# Altium project VLC_RX.PrjPcb
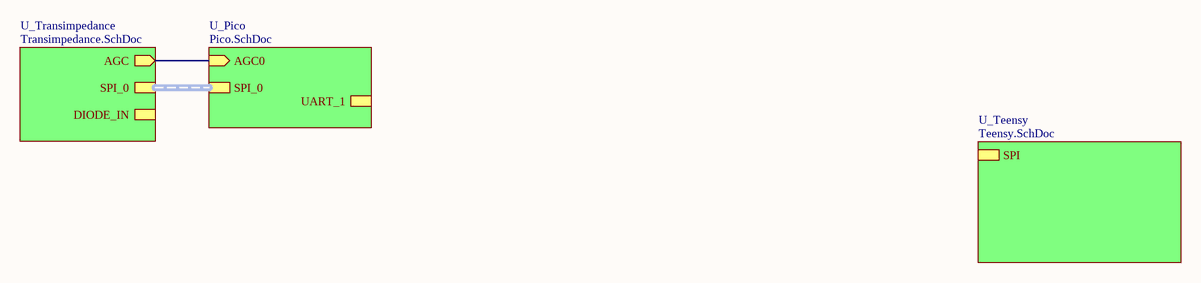
[diagram p0: VLC_RX.SchDoc]
4 sheets, 29 parts. Net scope: hierarchical (ports join the sheet entries above them; power ports are global).
Sheets:
  VLC_RX.SchDoc
    U_Pico = Pico.SchDoc
    U_Teensy = Teensy.SchDoc
    U_Transimpedance = Transimpedance.SchDoc

## Sheet VLC_RX.SchDoc
size A4; SheetNumber: 1; SheetTotal: 4

### Sub-sheets
U_Pico = Pico.SchDoc: SPI_0 (harness SPI_0), AGC0 (in), UART_1 (harness UART_1)
U_Teensy = Teensy.SchDoc: SPI (harness SPI)
U_Transimpedance = Transimpedance.SchDoc: DIODE_IN, SPI_0 (harness SPI_0), AGC (out)

### Nets
GPIO26: sheet U_Pico/AGC0, sheet U_Transimpedance/AGC

### Buses and harness runs
harness sheet U_Pico/SPI_0 = sheet U_Transimpedance/SPI_0

## Sheet Pico.SchDoc
size A4; SheetNumber: 3; SheetTotal: 4
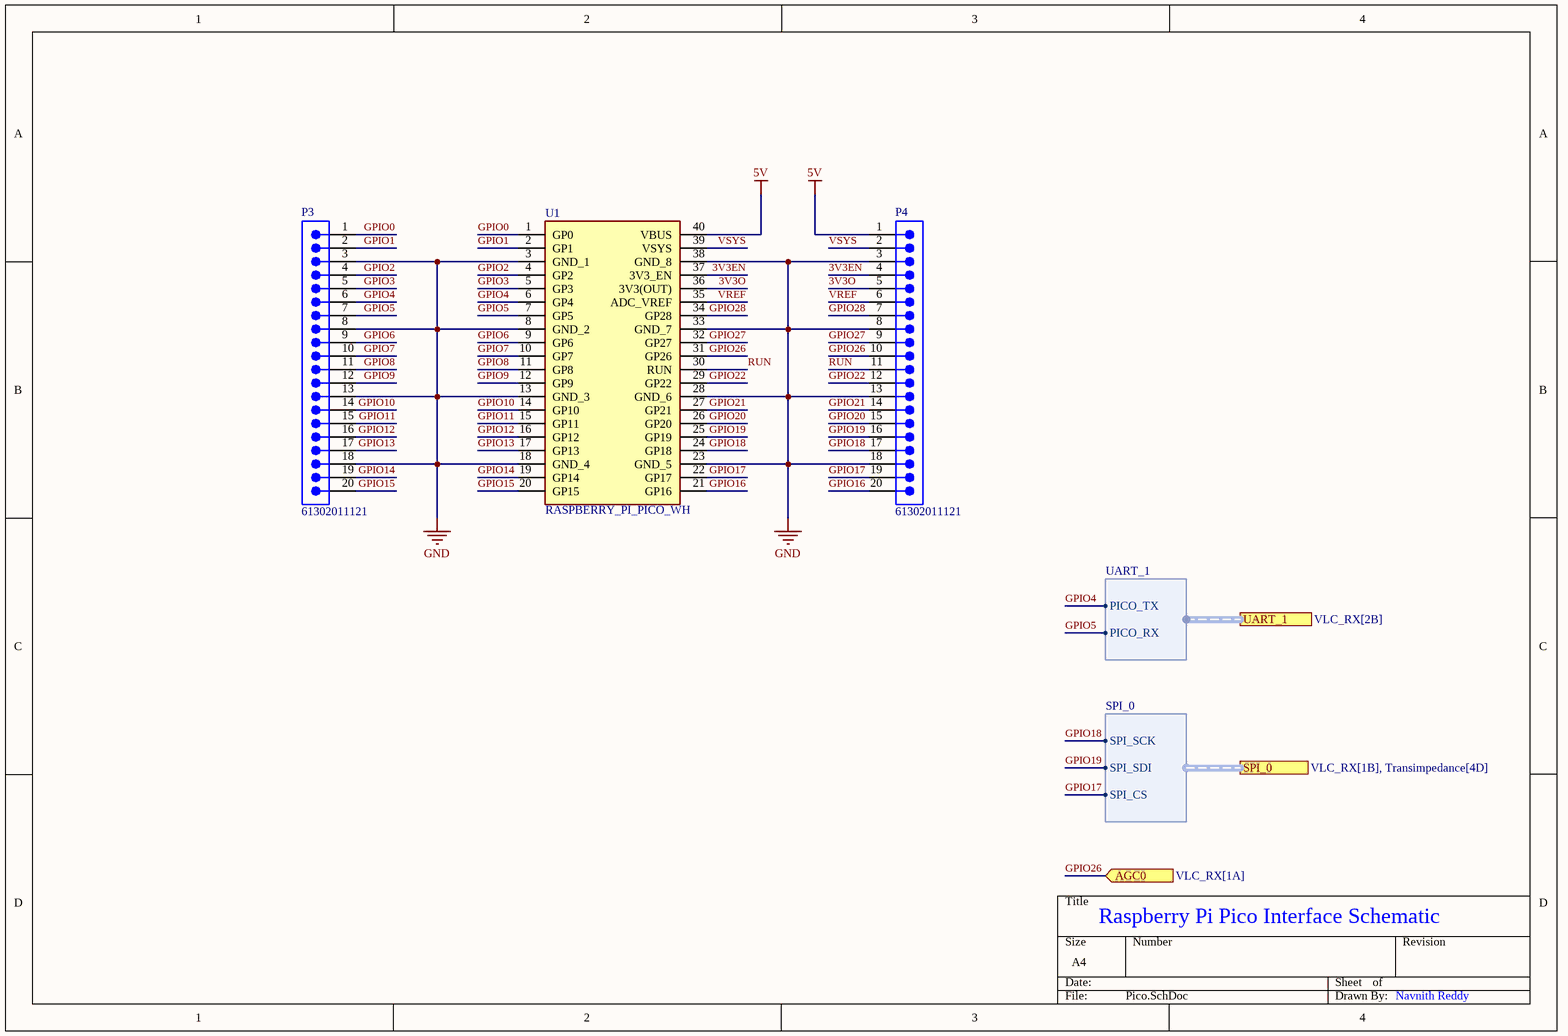
[diagram p1: Pico.SchDoc]

### Parts
P3  61302011121  [61302011121]
P4  61302011121  [61302011121]
U1  RASPBERRY_PI_PICO_WH  [RASPBERRYPIPICOWH]

### Ports
AGC0 (in, see VLC_RX[1A]), SPI_0 (harness SPI_0, see VLC_RX[1B], Transimpedance[4D]), UART_1 (harness UART_1, see VLC_RX[2B])

### Harnesses
SPI_0: SPI_SCK, SPI_SDI, SPI_CS
UART_1: PICO_TX, PICO_RX

### Nets
5V: P4.1 U1.40(VBUS)
GND: P3.3 P3.8 P3.13 P3.18 P4.3 P4.8 P4.13 P4.18 U1.3(GND_1) U1.8(GND_2) U1.13(GND_3) U1.18(GND_4) U1.23(GND_5) U1.28(GND_6) U1.33(GND_7) U1.38(GND_8)
3V3EN: P4.4 U1.37(3V3_EN)
3V3O: P4.5 U1.36(3V3(OUT))
GPIO0: P3.1 U1.1(GP0)
GPIO1: P3.2 U1.2(GP1)
GPIO2: P3.4 U1.4(GP2)
GPIO3: P3.5 U1.5(GP3)
GPIO4: P3.6 U1.6(GP4) ; port UART_1.PICO_TX
GPIO5: P3.7 U1.7(GP5) ; port UART_1.PICO_RX
GPIO6: P3.9 U1.9(GP6)
GPIO7: P3.10 U1.10(GP7)
GPIO8: P3.11 U1.11(GP8)
GPIO9: P3.12 U1.12(GP9)
GPIO10: P3.14 U1.14(GP10)
GPIO11: P3.15 U1.15(GP11)
GPIO12: P3.16 U1.16(GP12)
GPIO13: P3.17 U1.17(GP13)
GPIO14: P3.19 U1.19(GP14)
GPIO15: P3.20 U1.20(GP15)
GPIO16: P4.20 U1.21(GP16)
GPIO17: P4.19 U1.22(GP17) ; port SPI_0.SPI_CS  [project net CSn]
GPIO18: P4.17 U1.24(GP18) ; port SPI_0.SPI_SCK
GPIO19: P4.16 U1.25(GP19) ; port SPI_0.SPI_SDI
GPIO20: P4.15 U1.26(GP20)
GPIO21: P4.14 U1.27(GP21)
GPIO22: P4.12 U1.29(GP22)
GPIO26: P4.10 U1.31(GP26) ; port AGC0
GPIO27: P4.9 U1.32(GP27)
GPIO28: P4.7 U1.34(GP28)
RUN: P4.11 U1.30(RUN)
VREF: P4.6 U1.35(ADC_VREF)
VSYS: P4.2 U1.39(VSYS)

### Notes on the sheet
- Raspberry Pi Pico Interface Schematic
- Navnith Reddy

### Library data of the parts
P3 P4 = CMP-1502-01102-2: NexarPartId: 32855554; Number of Contacts: 20; Contact Resistance: 20mΩ; Pitch: 2.54mm; Gender: Male; Operating Supply Voltage: 250V; Connector Type: Male Pin; Current Rating: 3A; Packaging: Bulk; RoHS: Compliant; Contact Material: Copper; Contact Mating Length: 5.9944mm; Number of Positions: 20; Orientation: Vertical; Termination: Solder; Number of Pins: 20; Color: Black; REACH SVHC: Unknown; Mount: Through Hole; Contact Plating: Gold; Number of Rows: 1; Lead Pitch: 2.54mm
U1 = RASPBERRY_PI_PICO_WH: Undefined or Miscellaneous; Manufacturer_Name: RASPBERRY-PI; Manufacturer_Part_Number: RASPBERRY PI PICO WH; Datasheet Link: https://datasheets.raspberrypi.com/picow/pico-w-datasheet.pdf; Height: 4mm

## Sheet Teensy.SchDoc
size A4; SheetNumber: 2; SheetTotal: 4
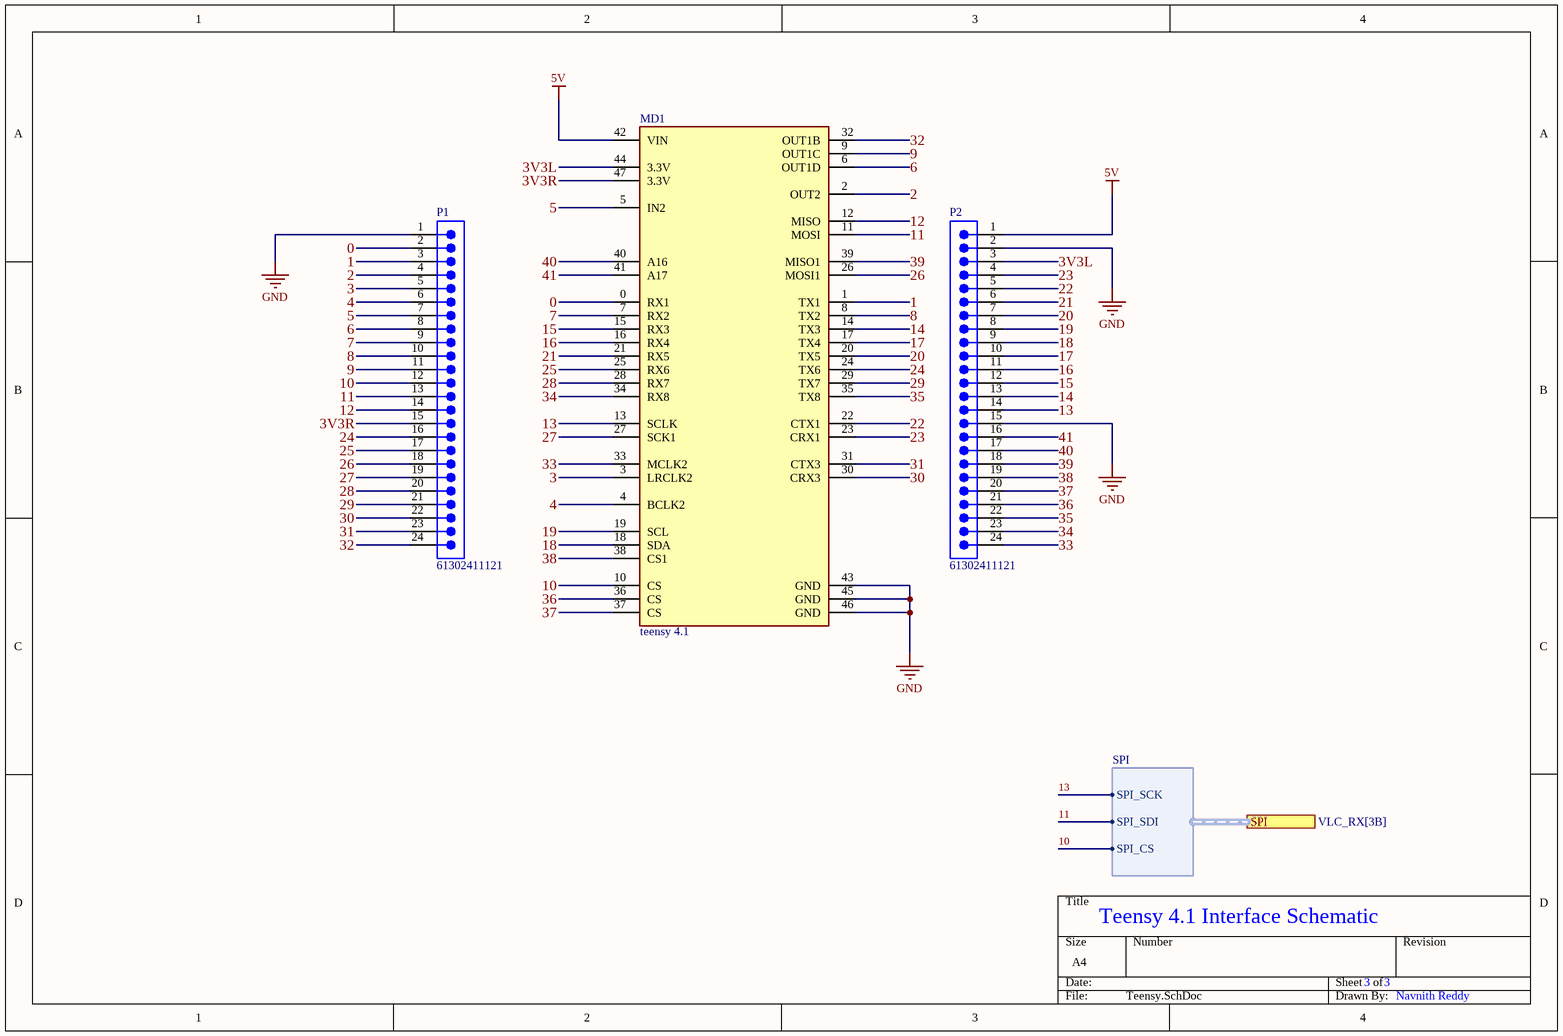
[diagram p2: Teensy.SchDoc]

### Parts
MD1  teensy 4.1  [FP-DEV-16996-MFG]
P1  61302411121  [61302411121]
P2  61302411121  [61302411121]

### Ports
SPI (harness SPI, see VLC_RX[3B])

### Harnesses
SPI: SPI_SCK, SPI_SDI, SPI_CS

### Nets
5V: MD1.42(VIN) P2.1
GND: MD1.43(GND) MD1.45(GND) MD1.46(GND) P1.1 P2.2 P2.15
0: MD1.0(RX1) P1.2
1: MD1.1(TX1) P1.3
2: MD1.2(OUT2) P1.4
3: MD1.3(LRCLK2) P1.5
3V3L: MD1.44(3.3V) P2.3
3V3R: MD1.47(3.3V) P1.15
4: MD1.4(BCLK2) P1.6
5: MD1.5(IN2) P1.7
6: MD1.6(OUT1D) P1.8
7: MD1.7(RX2) P1.9
8: MD1.8(TX2) P1.10
9: MD1.9(OUT1C) P1.11
10: MD1.10(CS) P1.12 ; port SPI.SPI_CS
11: MD1.11(MOSI) P1.13 ; port SPI.SPI_SDI
12: MD1.12(MISO) P1.14
13: MD1.13(SCLK) P2.14 ; port SPI.SPI_SCK
14: MD1.14(TX3) P2.13
15: MD1.15(RX3) P2.12
16: MD1.16(RX4) P2.11
17: MD1.17(TX4) P2.10
18: MD1.18(SDA) P2.9
19: MD1.19(SCL) P2.8
20: MD1.20(TX5) P2.7
21: MD1.21(RX5) P2.6
22: MD1.22(CTX1) P2.5
23: MD1.23(CRX1) P2.4
24: MD1.24(TX6) P1.16
25: MD1.25(RX6) P1.17
26: MD1.26(MOSI1) P1.18
27: MD1.27(SCK1) P1.19
28: MD1.28(RX7) P1.20
29: MD1.29(TX7) P1.21
30: MD1.30(CRX3) P1.22
31: MD1.31(CTX3) P1.23
32: MD1.32(OUT1B) P1.24
33: MD1.33(MCLK2) P2.24
34: MD1.34(RX8) P2.23
35: MD1.35(TX8) P2.22
36: MD1.36(CS) P2.21
37: MD1.37(CS) P2.20
38: MD1.38(CS1) P2.19
39: MD1.39(MISO1) P2.18
40: MD1.40(A16) P2.17
41: MD1.41(A17) P2.16

### Notes on the sheet
- Teensy 4.1 Interface Schematic
- 3
- Navnith Reddy

### Library data of the parts
MD1 = CMP-157412-000001-1: TEENSY 4.1 (HEADERS)
P1 P2 = CMP-1502-01109-2: NexarPartId: 32855561; Number of Contacts: 24; Connector Type: Male Pin; Operating Supply Voltage: 250V; Pitch: 2.54mm; Gender: Male; Current Rating: 3A; Contact Resistance: 20mΩ; Mount: Through Hole; Contact Plating: Gold; Lead Pitch: 2.54mm; Orientation: Vertical; Color: Black; Packaging: Bulk; REACH SVHC: Unknown; Termination: Solder; Number of Positions: 24; RoHS: Compliant; Contact Mating Length: 5.9944mm; Number of Pins: 24; Contact Material: Copper; Number of Rows: 1

## Sheet Transimpedance.SchDoc
size A4; SheetNumber: 4; SheetTotal: 4
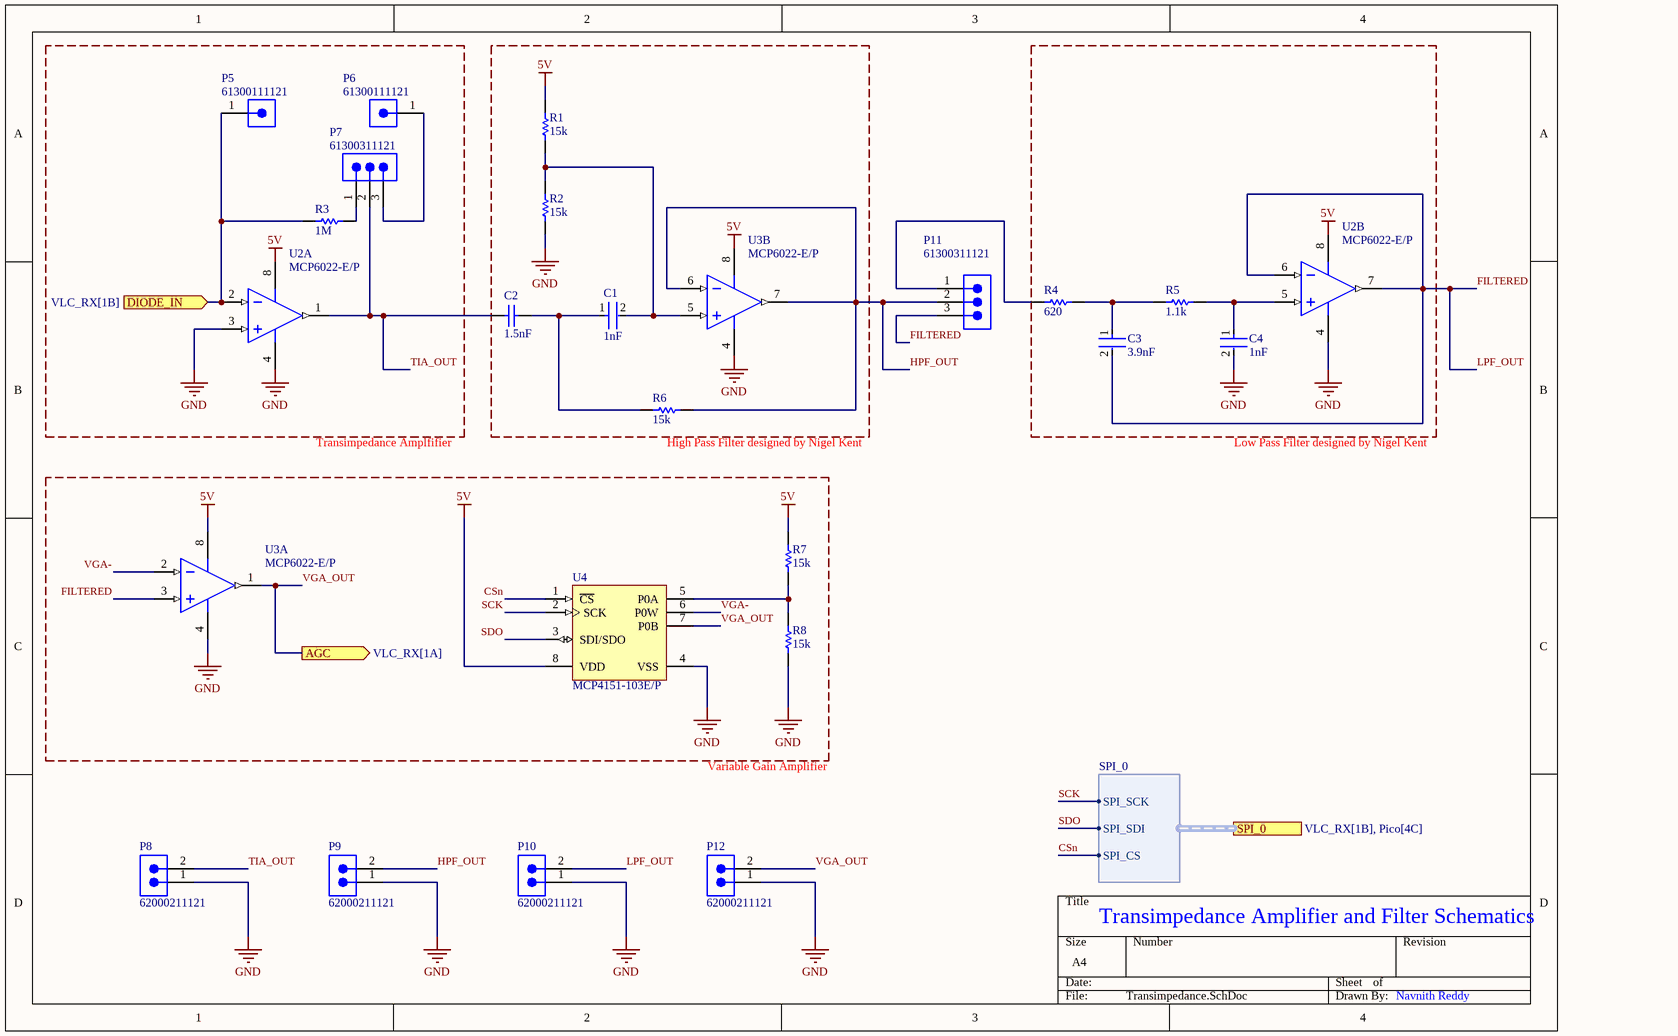
[diagram p3: Transimpedance.SchDoc]

### Parts
C1  1nF  [FP-0805-L_2_01_0_2-W_1_25-IPC_C]
C2  1.5nF  [CAPC2013X94X50ML20T25]
C3  3.9nF  [FP-C0805C-DN-MFG]
C4  1nF  [FP-0805-L_2_01_0_2-W_1_25-IPC_C]
P5  61300111121  [61300111121]
P6  61300111121  [61300111121]
P7  61300311121  [61300311121]
P8  62000211121  [62000211121]
P9  62000211121  [62000211121]
P10  62000211121  [62000211121]
P11  61300311121  [61300311121]
P12  62000211121  [62000211121]
R1  15k  [RESC2013X55X40NL15T20]
R2  15k  [RESC2013X55X40NL15T20]
R3  1M  [RESC2013X60X40LL20T25]
R4  620  [RESC2013X70X40LL20T20]
R5  1.1k  [RESC2013X50X30LL20T20]
R6  15k  [RESC2013X55X40NL15T20]
R7  15k  [RESC2013X55X40NL15T20]
R8  15k  [RESC2013X55X40NL15T20]
U2  MCP6022-E/P  [PDIP300-P8]  (parts A,B of 2)
U3  MCP6022-E/P  [PDIP300-P8]  (parts A,B of 2)
U4  MCP4151-103E/P  [PDIP300-P8]

### Ports
AGC (out, see VLC_RX[1A]), DIODE_IN (in, see VLC_RX[1B]), SPI_0 (harness SPI_0, see VLC_RX[1B], Pico[4C])

### Harnesses
SPI_0: SPI_SCK, SPI_SDI, SPI_CS

### Nets
5V: R1.2 R7.2 U2.8(VDD) U3.8(VDD) U4.8(VDD)
GND: C4.2 P8.1 P9.1 P10.1 P12.1 R2.1 R8.1 U2.3(VINA+) U2.4(VSS) U3.4(VSS) U4.4(VSS)
CSn: U4.1(~{CS}) ; port SPI_0.SPI_CS
FILTERED: C3.2 P10.2 P11.3 U2.6(VINB-) U2.7(VOUTB) U3.3(VINA+)  [also labelled LPF_OUT]
HPF_OUT: P9.2 P11.2 R6.2 U3.6(VINB-) U3.7(VOUTB)
SCK: U4.2(SCK) ; port SPI_0.SPI_SCK  [project net GPIO18]
SDO: U4.3(SDI/SDO) ; port SPI_0.SPI_SDI  [project net GPIO19]
TIA_OUT: C2.1 P7.2 P8.2 U2.1(VOUTA)
VGA-: U3.2(VINA-) U4.6(P0W)
VGA_OUT: P12.2 U3.1(VOUTA) U4.7(P0B) ; port AGC  [project net GPIO26]
NetC1_1: C1.1 C2.2 R6.1
NetC1_2: C1.2 R1.1 R2.2 U3.5(VINB+)
NetC3_1: C3.1 R4.2 R5.1
NetC4_1: C4.1 R5.2 U2.5(VINB+)
NetP5_1: P5.1 R3.1 U2.2(VINA-) ; port DIODE_IN
NetP6_1: P6.1 P7.3
NetP7_1: P7.1 R3.2
NetP11_1: P11.1 R4.1
NetR7_1: R7.1 R8.2 U4.5(P0A)

### Notes on the sheet
- Transimpedance Amplfifier
- (near R6) High Pass Filter designed by Nigel Kent
- Low Pass Filter designed by Nigel Kent
- Variable Gain Amplifier
- Transimpedance Amplifier and Filter Schematics
- Navnith Reddy

### Library data of the parts
C1 C4 = CMP-1036-02979-3: General Purpose Ceramic Capacitor, 0805, 1nF, 10%, X7R, 0.15, 50V; Dissipation Factor: 2.5%; Insulation Resistance: 100GR; Radiation Hardening: No; Case Code (Imperial): 0805; Packaging: Tape and Reel; Height: 0.94mm; Number of Pins: 2; REACH SVHC: No SVHC; Case Code (Metric): 2012; Voltage: 50V; Max Operating Temperature: 125°C; Tolerance: 10%; Voltage Rating: 50V; Depth: 1.25mm; Voltage Rating (DC): 50V; Thickness: 0.037inch; Termination: SMD/SMT; Package Quantity: 1; RoHS Compliant: Yes; Mount: Surface Mount; Dielectric: X7R; Length: 2.01mm; Contact Plating: Tin; Lead Free: Lead Free; Case/Package: 0805; Width: 1.25mm; Capacitance: 1nF; Dielectric Material: Ceramic; Min Operating Temperature: -55°C
C2 = CMP-2007-04179-1: Manufacturer: AVX Interconnect / Elco; Part Number: 08051C152KAT2A
C3 = CMP-2007-03730-2: CAP CER 3900PF 200V C0G/NP0 0805; Manufacturer Part Number: C0805C392J2GACAUTO; Manufacturer: KEMET; Temperature Characteristic: C0G; Value: 3,900 pF; Description: C0805 3,900 pF C0G 30ppm/°C 5.00% 200 V; Material: Ceramic; Tolerance: 0.05; Temperature Coefficient: 30ppm/°C; Category: Cap; Lead Free: Yes; Device Class L1: Passive Components; Temperature Range Low: -55°C; Temperature Range High: +125°C; Height: 0.88mm; Voltage Rating: 200 V; Device Class L2: Capacitors; Octopart: https://octopart.com/c0805c392j2gacauto-kemet-46733246; Capacitance: 3,900 pF; Temperature: -55°C to +125°C; Ipc Land Pattern Name: CAPC200125X78; Automotive: No; Digikey Description: CAP CER 3900PF 200V C0G/NP0 0805; ComponentLink2URL: https://content.kemet.com/datasheets/KEM_C1003_C0G_SMD.pdf; Device Class L3: Ceramic Capacitors; Package: C0805C-DN; RoHS: TRUE; ComponentLink2Description: Datasheet
P5 P6 = CMP-1502-01058-2: NexarPartId: 32855518; Operating Supply Voltage: 250V; Connector Type: Male Pin; Contact Resistance: 20mΩ; Number of Contacts: 1; Gender: Male; Current Rating: 3A; Contact Mating Length: 5.9944mm; Number of Pins: 1; Lead Pitch: 2.54mm; Contact Plating: Gold; RoHS: Compliant; Termination: Solder; Mount: Through Hole; Number of Rows: 1; Orientation: Vertical; Contact Material: Copper; Packaging: Bulk; REACH SVHC: Unknown; Number of Positions: 1; Color: Black
P7 P11 = CMP-1502-01062-2: NexarPartId: 32855521; Voltage Rating: 250V; Current Rating: 3A; Connector Type: Male Pin; Number of Positions: 3; Gender: Male; Contact Resistance: 20mΩ; Pitch: 2.54mm; Max Operating Temperature: 105°C; Lead Pitch: 2.54mm; Lead Free: Lead Free; Contact Mating Length: 5.9944mm; Contact Material: Copper; Number of Pins: 3; Orientation: Vertical; Height: 8.94mm; Packaging: Bulk; Min Operating Temperature: -40°C; Mount: Through Hole; RoHS: Compliant; Number of Contacts: 3; Operating Supply Voltage: 250V; Termination: Solder; Number of Rows: 1; Contact Plating: Gold; Color: Black; REACH SVHC: Unknown
P8-P10 P12 = CMP-1502-00956-3: NexarPartId: 61924778; Number of Contacts: 2; Voltage Rating: 200V; Gender: Male; Contact Resistance: 20mΩ; Current Rating: 2A; Lead Pitch: 2mm; Max Operating Temperature: 105°C; Contact Material: Gold; Number of Rows: 1; Operating Supply Voltage: 200V; Number of Pins: 2; Orientation: Vertical; Min Operating Temperature: -40°C; Height: 6.35mm; RoHS: Non-Compliant
R1 R2 R6-R8 = CMP-2001-04735-1: Part Number: TNPW080515K0BEEA; Manufacturer: Vishay Dale
R3 = CMP-2001-00584-1: Part Number: ERA-6AEB105V; Manufacturer: Panasonic
R4 = CMP-2001-00436-1: Manufacturer: Panasonic; Part Number: ERJ-6GEYJ621V
R5 = CMP-1013-00514-2: Part Number: CRCW08051K10FKTA; Manufacturer: Vishay Dale
U2 U3 = CMP-0187-00090-3: None; Max Supply Voltage: 5.5V; Voltage Gain: 110dB; Input Bias Current: 5nA; Bandwidth: 10MHz; Number of Elements: 2; Min Supply Voltage: 2.5V; Input Offset Voltage-Max: 500uV; Power Supply Rejection Ratio (PSRR): 74dB; Nominal Supply Current: 1mA; Input Offset Voltage (Vos): 250uV; Amplifier Type: GENERAL PURPOSE; Common Mode Rejection Ratio: 70dB; Slew Rate-Nom: 7V/µs; Output Current: 22mA; Max Operating Temperature: 125°C; REACH SVHC: No SVHC; Height: 0.195inch; Length: 0.4inch; Min Operating Temperature: -40°C; Mount: Through Hole; Number of Amplifiers: 2; Harmonic Distortion: 0.00053%; Gain Bandwidth Product: 10MHz; RoHS Compliant: Yes; Unity Gain Bandwidth Product: 10MHz; Number of Channels: 2; Radiation Hardening: No; Technology: CMOS; Supply Current: 1mA; Package Quantity: 60; Lead Free: Lead Free; Width: 0.28inch; Slew Rate: 7V/µs; Case/Package: PDIP; Packaging: Rail/Tube; Number of Pins: 8; Number of Circuits: 2
U4 = CMP-0188-00257-2: 7/8-Bit Single/Dual SPI Digital POT with Volatile Memory, 8-Pin PDIP, Extended Temperature; RevisionNote: URLs added.; PackageReference: PDIP300-P8; ComponentLink1Description: Manufacturer URL; ComponentLink3URL: http://www.microchip.com/stellent/groups/techpub_sg/documents/packagingspec/en012702.pdf; PackageDescription: 8-Lead Plastic Dual In-Line (P) - 300 mil Body [PDIP]; ComponentLink2Description: Datasheet; Code_JEDEC: MS-001; ComponentLink2URL: http://ww1.microchip.com/downloads/en/DeviceDoc/22060b.pdf; DatasheetVersion: revB, Dec-2008; ComponentLink1URL: http://www.microchip.com/; ComponentLink3Description: Package Specification; PackageVersion: revBB, Aug-2009

## Nets that join several sheets
5V: Pico (P4.1 U1.40), Teensy (MD1.42 P2.1), Transimpedance (5 pins)
GND: Pico (16 pins), Teensy (6 pins), Transimpedance (11 pins)
CSn: Pico (P4.19 U1.22), Transimpedance (U4.1)
GPIO18: Pico (P4.17 U1.24), Transimpedance (U4.2)
GPIO19: Pico (P4.16 U1.25), Transimpedance (U4.3)
GPIO26: Pico (P4.10 U1.31), Transimpedance (P12.2 U3.1 U4.7)